# EAGLE design Frequency_synthesizer_v2.0 (EAGLE 9.6.2)

## Sheet 1 of 2
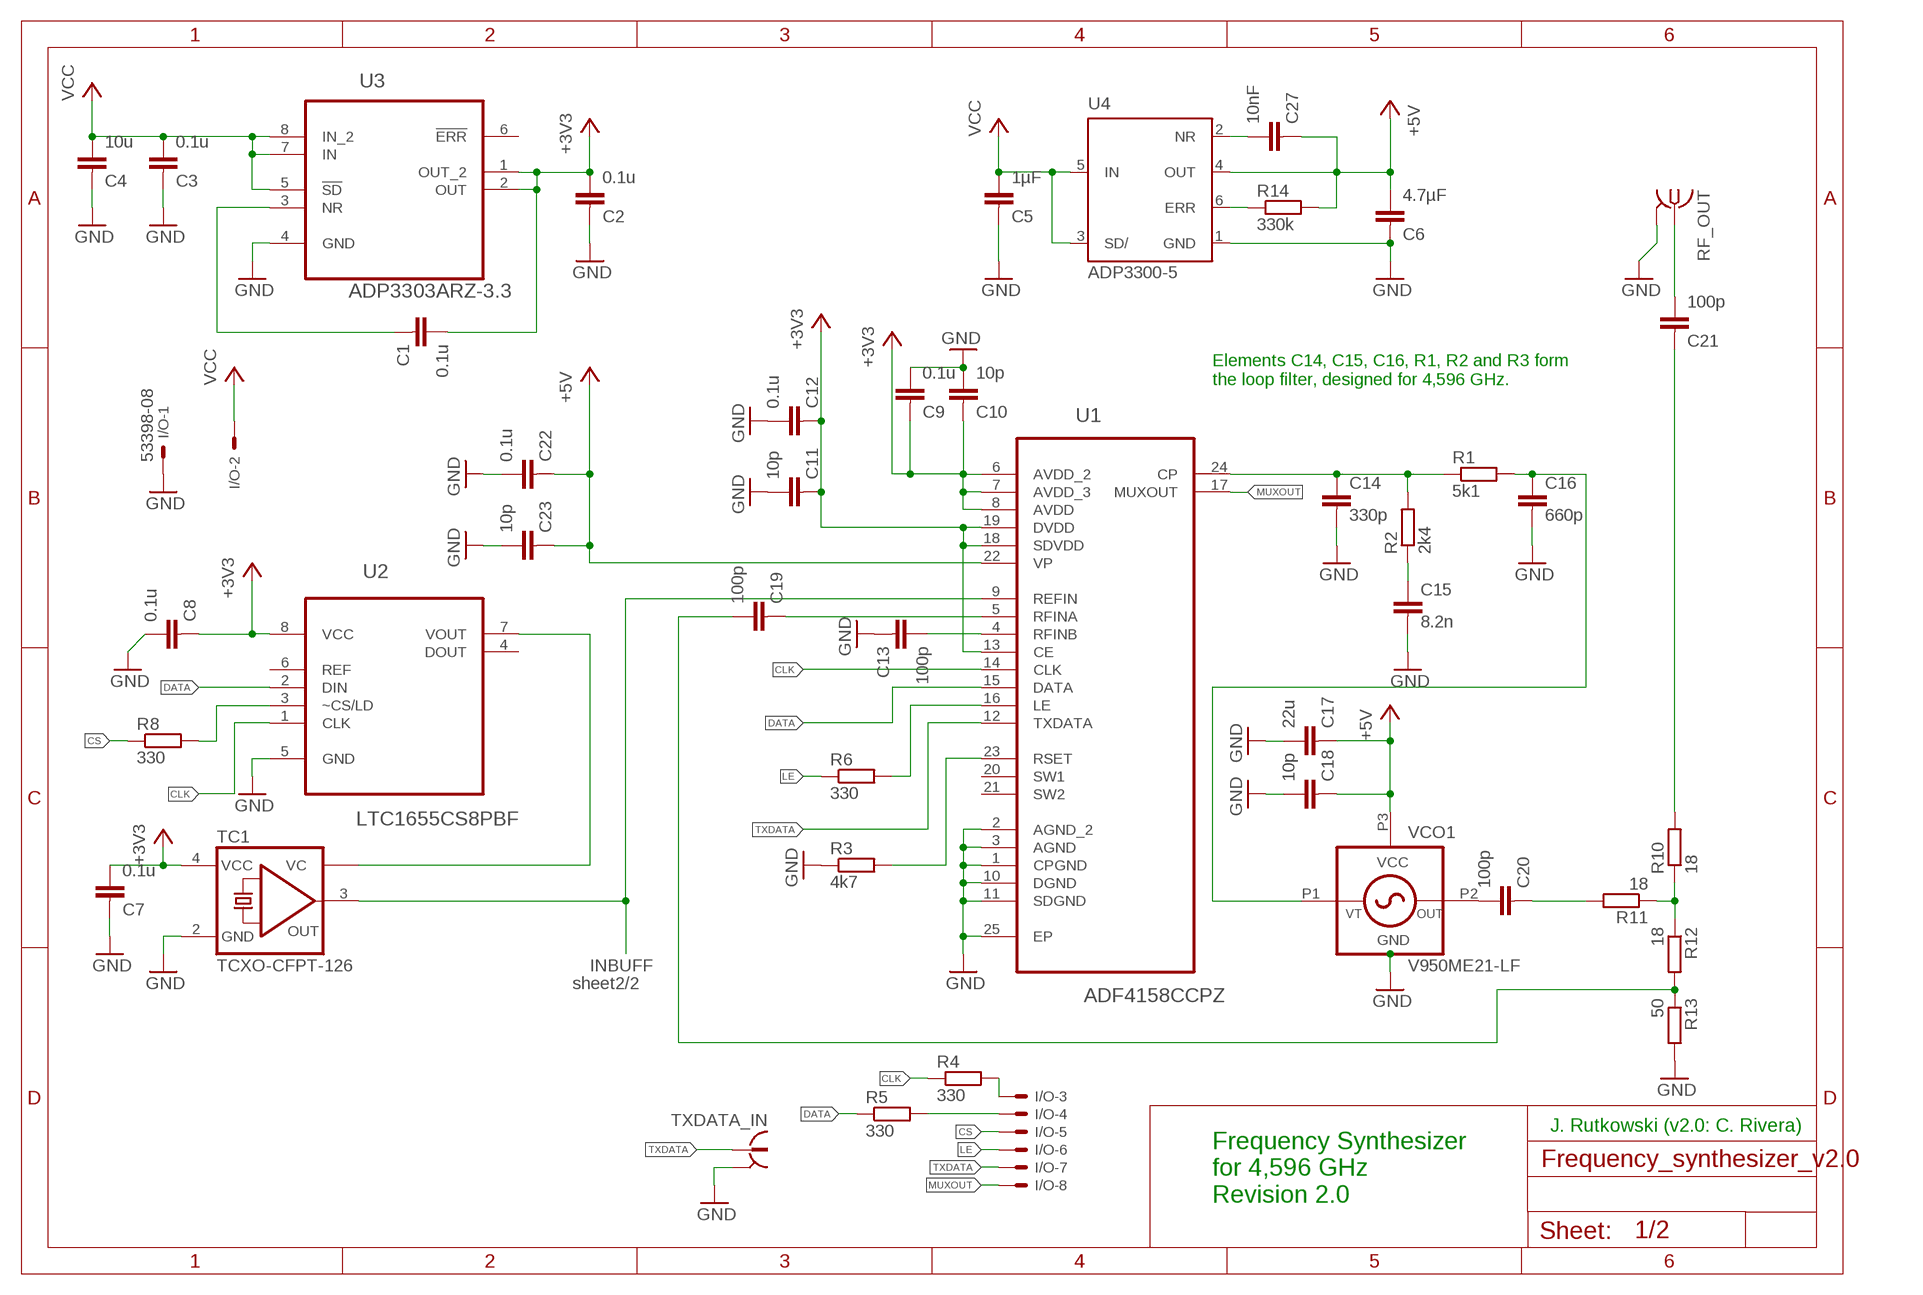
[diagram p0: schematic, sheet 1]

### Parts
C1  0.1u  C-EUC0603K  [C0603K]
C2  0.1u  C-EUC0603K  [C0603K]
C3  0.1u  C-EUC0603K  [C0603K]
C4  10u  C-EUC0805K  [C0805K]
C5  1µF  C-EUC0603K  [C0603K]
C6  4.7µF  C-EUC0603K  [C0603K]
C7  0.1u  C-EUC0603K  [C0603K]
C8  0.1u  C-EUC0603K  [C0603K]
C9  0.1u  C-EUC0603K  [C0603K]
C10  10p  C-EUC0603K  [C0603K]
C11  10p  C-EUC0603K  [C0603K]
C12  0.1u  C-EUC0603K  [C0603K]
C13  100p  C-EUC0402  [C0402]
C14  330p  C-EUC0603K  [C0603K]
C15  8.2n  C-EUC0603K  [C0603K]
C16  660p  C-EUC0603K  [C0603K]
C17  22u  C-EUC0805  [C0805]
C18  10p  C-EUC0603K  [C0603K]
C19  100p  C-EUC0402  [C0402]
C20  100p  C-EUC0402  [C0402]
C21  100p  C-EUC0402  [C0402]
C22  0.1u  C-EUC0603K  [C0603K]
C23  10p  C-EUC0603K  [C0603K]
C27  10nF  C-EUC0603K  [C0603K]
I/O  53398-08  [53398-08]
R1  5k1  R-EU_R0603  [R0603]
R2  2k4  R-EU_R0603  [R0603]
R3  4k7  R-EU_R0603  [R0603]
R4  330  R-EU_R0603  [R0603]
R5  330  R-EU_R0603  [R0603]
R6  330  R-EU_R0603  [R0603]
R8  330  R-EU_R0603  [R0603]
R10  18  R-EU_R0402  [R0402]
R11  18  R-EU_R0402  [R0402]
R12  18  R-EU_R0402  [R0402]
R13  50  R-EU_R0402  [R0402]
R14  330k  R-EU_R0603  [R0603]
RF_OUT  SMA-142-0711-871/876  [J502-ND-142-0711-871/876]
TC1  TCXO-CFPT-126  [7.0X5.0-4-PAD]
TXDATA_IN  734120110  [734120110]
U1  ADF4158CCPZ  [QFN50P400X400X80-25N]
U2  LTC1655CS8PBF  [SOIC127P600X175-8N]
U3  ADP3303ARZ-3.3  [SOIC127P600X175-8N]
U4  ADP3300-5  [SOT23-6]
VCO1  V950ME21-LF  MINI-14S  [MINI-14S]

### Nets
+3V3: C1.1 C2.1 C7.1 C8.2 C9.2 C10.2 C11.2 C12.2 TC1.4(VCC) U1.6(AVDD_2) U1.7(AVDD_3) U1.8(AVDD) U1.13(CE) U1.18(SDVDD) U1.19(DVDD) U2.8(VCC) U3.1(OUT_2) U3.2(OUT) ; also sheet 2
+5V: C6.1 C17.2 C18.2 C22.2 C23.2 C27.2 R14.2 U1.22(VP) U4.4(OUT) VCO1.P3(VCC)
CLK: R4.1 U1.14(CLK) U2.1(CLK)
CS: I/O.5 R8.1
DATA: R5.1 U1.15(DATA) U2.2(DIN)
GND: C2.2 C3.2 C4.2 C5.2 C6.2 C7.2 C8.1 C9.1 C10.1 C11.1 C12.1 C13.2 C14.2 C15.2 C16.2 C17.1 C18.1 C22.1 C23.1 I/O.1 R3.1 R13.2 RF_OUT.G@1 RF_OUT.G@2 RF_OUT.G@3 RF_OUT.G@4 TC1.2(GND) TXDATA_IN.S@1 TXDATA_IN.S@2 TXDATA_IN.S@3 U1.1(CPGND) U1.2(AGND_2) U1.3(AGND) U1.10(DGND) U1.11(SDGND) U1.25(EP) U2.5(GND) U3.4(GND) U4.1(GND) VCO1.S1 VCO1.S2 VCO1.S3 VCO1.S4 VCO1.S5 VCO1.S6 VCO1.S7 VCO1.S8 VCO1.S9 VCO1.S10 VCO1.S11 ; also sheet 2
INBUFF: TC1.3(OUT) U1.9(REFIN) ; also sheet 2
LE: I/O.6 R6.1
MUXOUT: I/O.8 U1.17(MUXOUT)
N$1: C14.1 R1.1 R2.2 U1.24(CP)
N$2: C16.1 R1.2 VCO1.P1(VT)
N$3: C1.2 U3.3(NR)
N$4: C15.1 R2.1
N$5: C13.1 U1.4(RFINB)
N$6: R8.2 U2.3(~CS/LD)
N$7: I/O.4 R5.2
N$8: I/O.3 R4.2
N$9: R14.1 U4.6(ERR)
N$10: TC1.1(VC) U2.7(VOUT)
N$13: R6.2 U1.16(LE)
N$14: R3.2 U1.23(RSET)
N$15: C20.1 VCO1.P2(OUT)
N$16: C20.2 R11.2
N$17: R10.1 R11.1 R12.1
N$18: C19.1 R12.2 R13.1
N$19: C21.2 R10.2
N$20: C21.1 RF_OUT.1
N$21: C19.2 U1.5(RFINA)
N$26: C27.1 U4.2(NR)
TXDATA: I/O.7 TXDATA_IN.1 U1.12(TXDATA)
VCC: C3.1 C4.1 C5.1 I/O.2 U3.5(!SD) U3.7(IN) U3.8(IN_2) U4.3(SD/) U4.5(IN)
Unconnected: U1.20(SW1) U1.21(SW2) U2.4(DOUT) U2.6(REF) U3.6(!ERR)

### Notes on the sheet
- Elements C14, C15, C16, R1, R2 and R3 form
  the loop filter, designed for 4,596 GHz.
- sheet2/2
- J. Rutkowski (v2.0: C. Rivera)
- Frequency Synthesizer
  for 4,596 GHz
  Revision 2.0

## Sheet 2 of 2
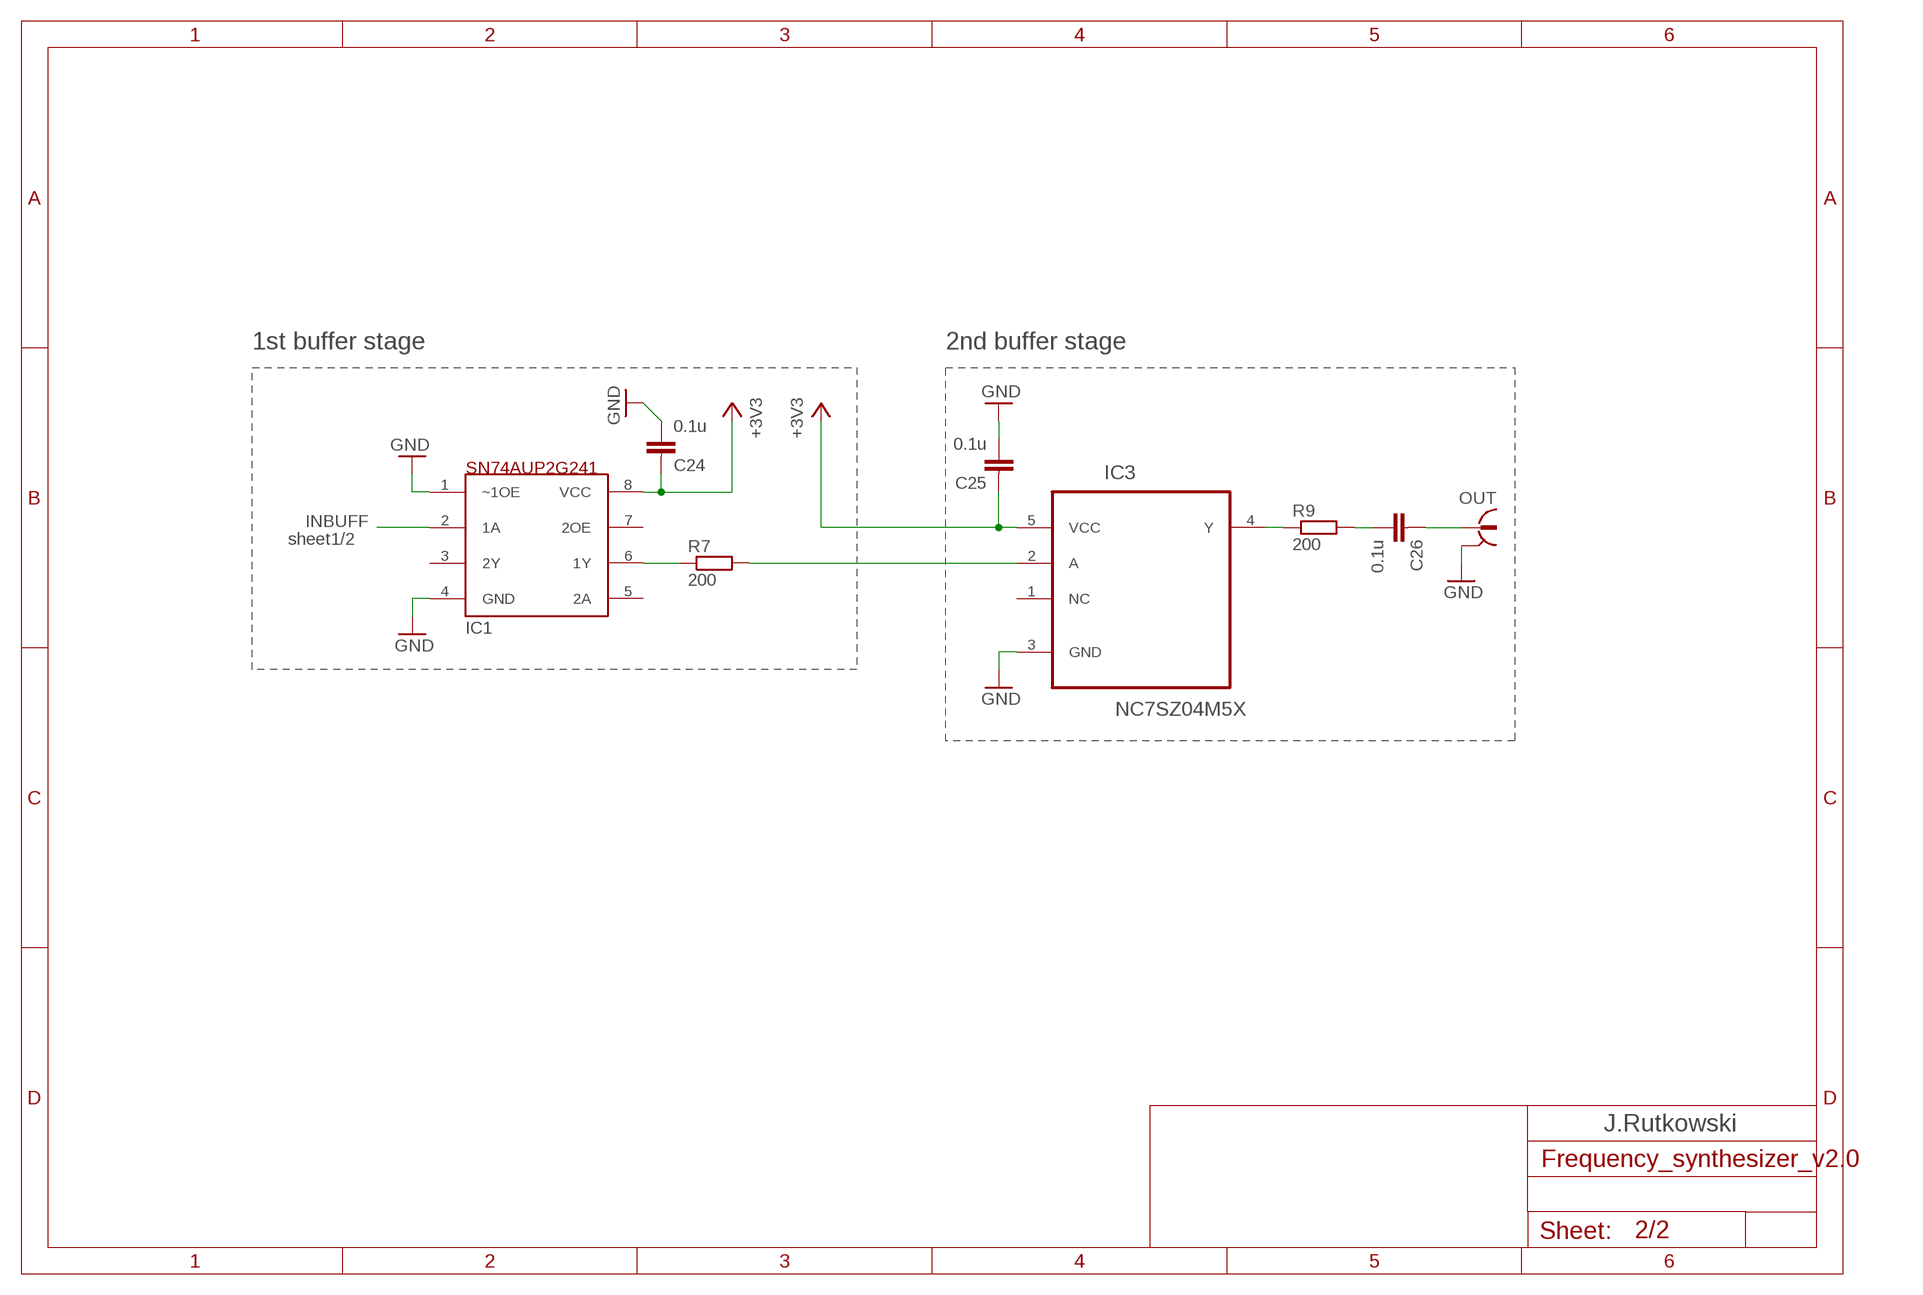
[diagram p1: schematic, sheet 2]

### Parts
C24  0.1u  C-EUC0603K  [C0603K]
C25  0.1u  C-EUC0603K  [C0603K]
C26  0.1u  C-EUC0603K  [C0603K]
IC1  SN74AUP2G241  [DCU_(R-PDSO-G8)]
IC3  NC7SZ04M5X  [SOT95P280X145-5N]
OUT  734120110  [734120110]
R7  200  R-EU_R0603  [R0603]
R9  200  R-EU_R0603  [R0603]

### Nets
+3V3: C24.2 C25.2 IC1.8(VCC) IC3.5(VCC) ; also sheet 1
GND: C24.1 C25.1 IC1.1(~1OE) IC1.4(GND) IC3.3(GND) OUT.S@1 OUT.S@2 OUT.S@3 ; also sheet 1
INBUFF: IC1.2(1A) ; also sheet 1
N$12: IC1.6(1Y) R7.1
N$22: IC3.2(A) R7.2
N$23: IC3.4(Y) R9.1
N$24: C26.1 R9.2
N$25: C26.2 OUT.1
Unconnected: IC1.3(2Y) IC1.5(2A) IC1.7(2OE) IC3.1(NC)

### Notes on the sheet
- 1st buffer stage | 2nd buffer stage
- sheet1/2
- J.Rutkowski

## Library data of the parts
C1-C27 = rcl:C-EU: CAPACITOR, European symbol
I/O = con-molex:53?-08: CONNECTOR wire to board 1.25 mm (.049 inch) pitch header; OC_FARNELL: 1125371; OC_NEWARK: unknown
IC1 = texas:SN74AUP2G241
IC3 = Custom-parts:NC7SZ04M5X: Tiny logic UHS Inverter; MPN: NC7SZ04M5X; OC_FARNELL: 1417667; OC_NEWARK: 58K1973; PACKAGE: SOT-23-5; SUPPLIER: Fairchild
OUT TXDATA_IN = con-coax:734120110: MICRO COAXIAL CONNECTOR RECEPTACLE VERTICAL Source: Data sheet <http://www.molex.com/pdm_docs/sd/734120110_sd.pdf>
R1-R14 = rcl:R-EU_: RESISTOR, European symbol
RF_OUT = con-coax:SMA-: SMA 50 Ohm End Launch Jack Receptacle - Round Contact Johnson Components Source: www.johnsoncomponents.com .. J502-ND.pdf; MF: JOHNSON COMPONENTS; MPN: 142-0711-871; OC_FARNELL: unknown; OC_NEWARK: 01C1639
TC1 = IQD-Frequency-Products:TCXO: CRYSTAL RESONATOR
U1 = AD_PLL:ADF4158CCPZ: Frequency Synthesizer; MPN: ADF4158CCPZ; OC_FARNELL: -; OC_NEWARK: 76R7557; PACKAGE: LFCSP-24; SUPPLIER: Analog Devices
U2 = LTC_By_element14_Batch_1:LTC1655CS8PBF: 16-Bit Rail-to-Rail Micropower DAC; MPN: LTC1655CS8#PBF; OC_FARNELL: 1663654; OC_NEWARK: 56M2907; PACKAGE: SOIC-8; SUPPLIER: Linear Technology
U3 = analog-devices:ADP3303ARZ-3.3: Linear Regulator; MPN: ADP3303ARZ-3.3; OC_FARNELL: 2305721; OC_NEWARK: 59K2583; PACKAGE: SOIC-8; SUPPLIER: ANALOG DEVICES
U4 = analog-devices:ADP3300-5; DIGIKEY: ADP3300ARTZ-5REEL7CT-ND
VCO1 = z-comm:MINI-14S: VCO

## Board
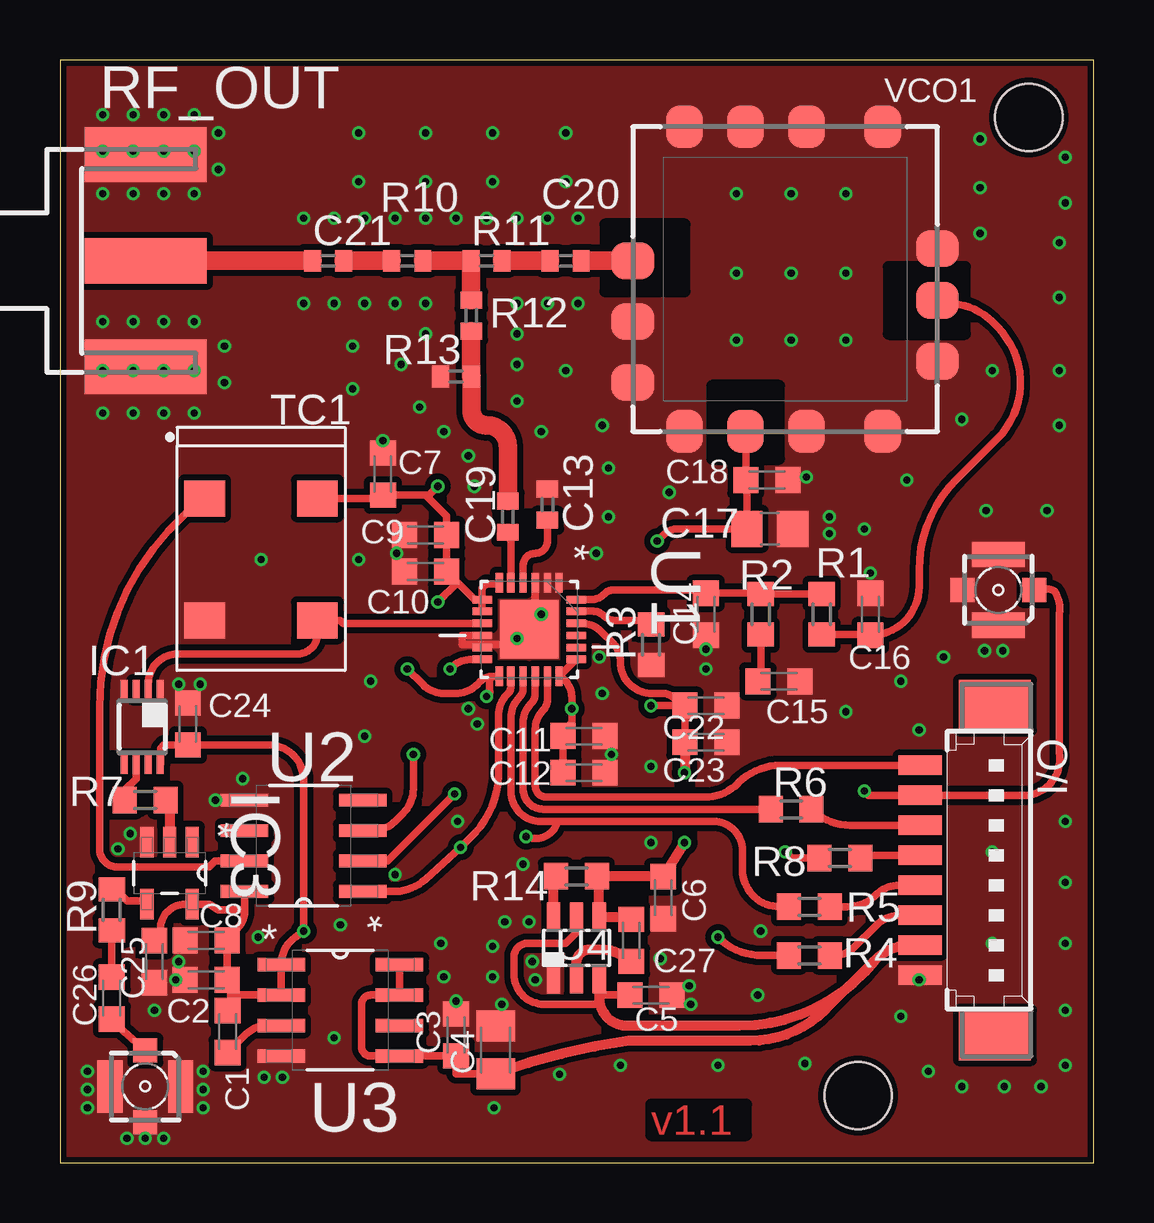
[diagram p2: board, top side]
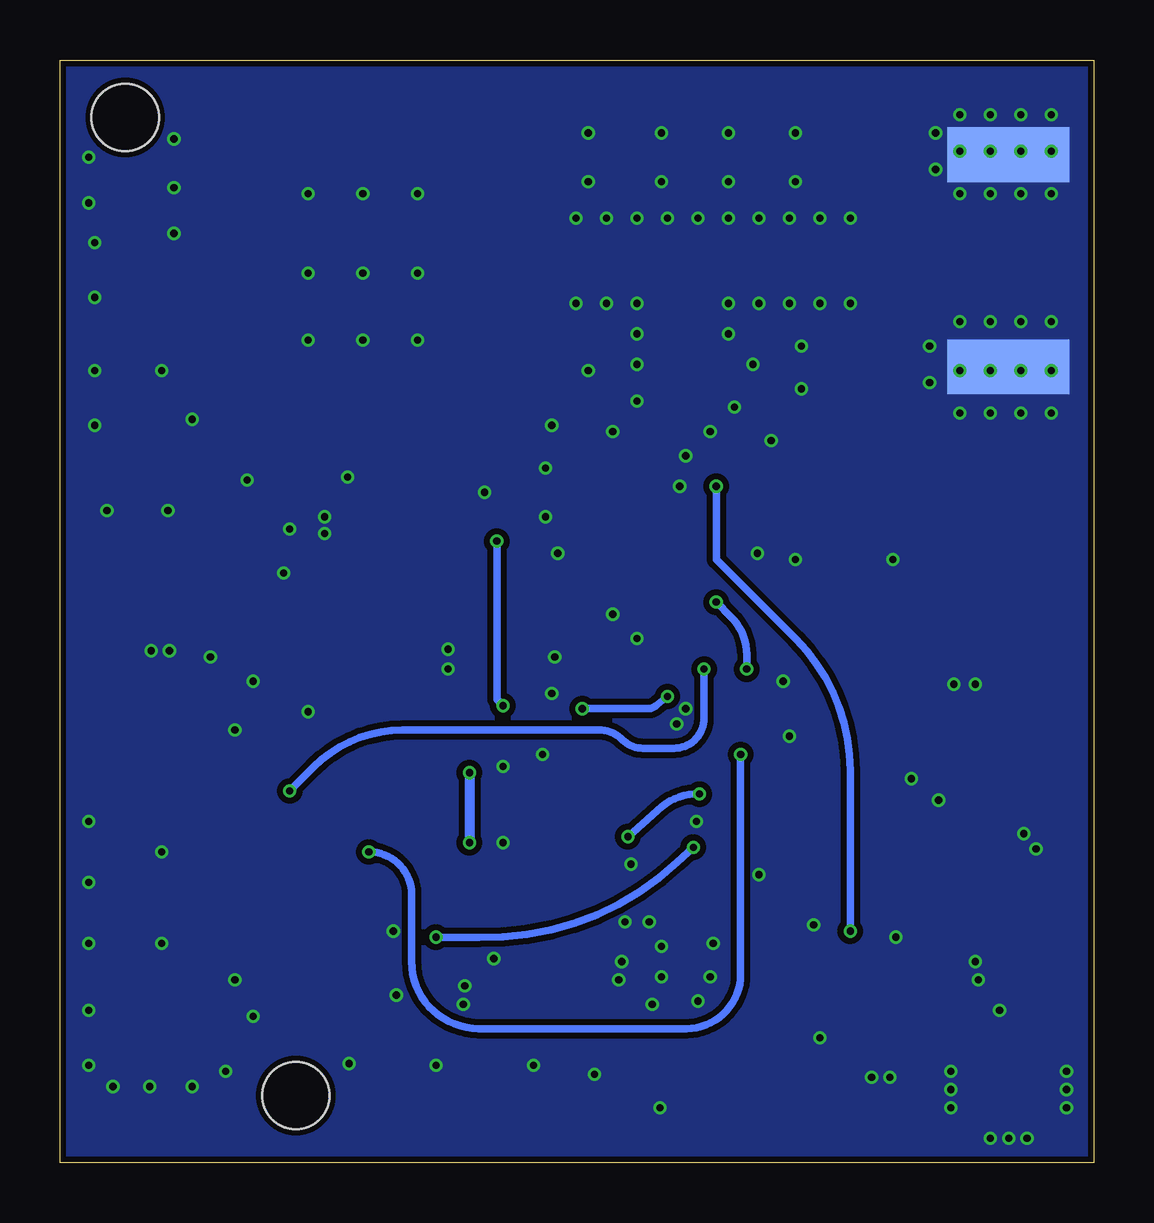
[diagram p3: board, bottom side, seen from below]

Size 43.1 x 45.96 mm. Coordinates in mm from the lower left corner, seen from the top.
Outline: 0,0 43.1,0 43.1,45.96 0,45.96 0,0
Copper layers (1*16): Top 0.018mm / dielectric 1.55mm / Bottom 0.018mm
Design rules "eC_2Layer_PClass6_BaseCopperO18_eCDefault *": minimum track width 0.15mm, minimum drill 0.35mm, track to track 0.15mm, track to pad 0.15mm, pad to pad 0.15mm, via to via 0.15mm, smd to smd 0mil, copper to edge 0.25mm, drill to drill 0.35mm, minimum pad ring 0.175mm, minimum via ring 0.125mm, stop-mask expansion 0mil, vias tented up to drill 0.45mm, thermal gap 0.2mm
Holes 2.8 mm at 40.39,43.56 33.27,2.79

### Footprints (pad centres in the part's own frame; a part is rotated, then mirrored left to right if it is on the bottom)
C0603K = smd 1.05 x 1.08: 1 -0.875,0; 2 0.875,0
C0805K = smd 1.3 x 1.6: 1 -1,0; 2 1,0
C0402 = smd 0.7 x 0.9: 1 -0.65,0; 2 0.65,0
C0805 = smd 1.3 x 1.5: 1 -0.95,0; 2 0.95,0
53398-08 = smd 0.8 x 1.8: 1 4.375,-2.5; 2 3.125,-2.5; 3 1.875,-2.5; 4 0.625,-2.5; 5 -0.625,-2.5; 6 -1.875,-2.5; 7 -3.125,-2.5; 8 -4.375,-2.5 | smd 2.1 x 3: S1 6.875,0.625; S2 -6.875,0.625
DCU_(R-PDSO-G8) = smd 0.3 x 0.8: 1 -0.75,-1.55; 2 -0.25,-1.55; 3 0.25,-1.55; 4 0.75,-1.55; 5 0.75,1.55; 6 0.25,1.55; 7 -0.25,1.55; 8 -0.75,1.55
SOT95P280X145-5N = smd 1.27 x 0.559: 1 -1.295,0.94; 2 -1.295,0; 3 -1.295,-0.94; 4 1.295,-0.94; 5 1.295,0.94
734120110 = smd 1 x 1: 1 0,-1.5; S@1 0,1.5 | smd 1.05 x 2.2: S@2 -1.475,0; S@3 1.475,0
R0603 = smd 1 x 1.1: 1 -0.85,0; 2 0.85,0
R0402 = smd 0.7 x 0.9: 1 -0.65,0; 2 0.65,0
J502-ND-142-0711-871/876 = smd 5.08 x 1.905: 1 2.565,0 | smd 5.08 x 2.286: G@1 2.565,4.42; G@2 2.565,-4.42 | smd 5.08 x 2.286 bottom: G@3 2.565,4.42; G@4 2.565,-4.42
7.0X5.0-4-PAD = smd 1.5 x 1.7: 1 -2.54,-2.35; 2 2.54,-2.35; 3 2.54,2.35; 4 -2.54,2.35
QFN50P400X400X80-25N = smd 0.813 x 0.305: 1 -1.956,1.245; 2 -1.956,0.762; 3 -1.956,0.254; 4 -1.956,-0.254; 5 -1.956,-0.762; 6 -1.956,-1.245; 13 1.956,-1.245; 14 1.956,-0.762; 15 1.956,-0.254; 16 1.956,0.254; 17 1.956,0.762; 18 1.956,1.245 | smd 0.305 x 0.813: 7 -1.245,-1.956; 8 -0.762,-1.956; 9 -0.254,-1.956; 10 0.254,-1.956; 11 0.762,-1.956; 12 1.245,-1.956; 19 1.245,1.956; 20 0.762,1.956; 21 0.254,1.956; 22 -0.254,1.956; 23 -0.762,1.956; 24 -1.245,1.956 | smd 2.438 x 2.438: 25 0,0
SOIC127P600X175-8N = smd 1.981 x 0.533: 1 -2.464,1.905; 2 -2.464,0.635; 3 -2.464,-0.635; 4 -2.464,-1.905; 5 2.464,-1.905; 6 2.464,-0.635; 7 2.464,0.635; 8 2.464,1.905
SOIC127P600X175-8N' = smd 1.981 x 0.559: 1 -2.464,1.905; 2 -2.464,0.635; 3 -2.464,-0.635; 4 -2.464,-1.905; 5 2.464,-1.905; 6 2.464,-0.635; 7 2.464,0.635; 8 2.464,1.905
SOT23-6 = smd 0.55 x 1.2: 1 -0.95,-1.3; 2 0,-1.3; 3 0.95,-1.3; 4 0.95,1.3; 5 0.003,1.3; 6 -0.95,1.3
MINI-14S = smd 1.524 x 1.778: P1 -0.889,-6.35; P2 0.762,6.35; S1 -3.429,-6.35; S2 1.27,-6.35; S7 -1.778,6.35; S8 -4.318,6.35 | smd 1.778 x 1.524: P3 -6.35,1.651; S3 6.35,-4.064; S4 6.35,-0.889; S5 6.35,1.651; S6 6.35,4.191; S9 -6.35,4.191; S10 -6.35,-0.889; S11 -6.35,-4.064

### Placement (x,y rotation side)
C1  6.99,5.46 270 top
C2  6.1,7.62 180 top
C3  16.51,5.33 90 top
C4  18.16,4.7 90 top
C5  24.64,6.99 0 top
C6  25.15,11.05 270 top
C7  13.46,28.7 90 top
C8  6.1,9.27 0 top
C9  15.24,26.16 0 top
C10  15.24,24.64 0 top
C11  21.84,17.78 180 top
C12  21.84,16.26 180 top
C13  20.32,27.43 90 top
C14  26.92,22.86 270 top
C15  29.97,20.07 0 top
C16  33.78,22.86 90 top
C17  29.59,26.42 180 top
C18  29.46,28.45 180 top
C19  18.67,26.92 270 top
C20  21.08,37.59 180 top
C21  11.18,37.59 0 top
C22  26.92,19.05 180 top
C23  26.92,17.53 180 top
C24  5.33,18.29 270 top
C25  3.94,8.38 90 top
C26  2.16,6.86 270 top
C27  23.81,9.27 90 top
I/O  38.35,12.19 270 top
IC1  3.43,18.16 180 top
IC3  4.57,12.06 270 top
OUT  3.56,3.17 180 top
R1  31.75,22.86 270 top
R2  29.21,22.86 90 top
R3  24.64,21.59 90 top
R4  31.24,8.64 0 top
R5  31.24,10.67 0 top
R6  30.48,14.73 180 top
R7  3.56,15.11 0 top
R8  32.51,12.7 180 top
R9  2.16,10.54 270 top
R10  14.48,37.59 180 top
R11  17.78,37.59 0 top
R12  17.14,35.31 270 top
R13  16.51,32.77 180 top
R14  21.53,11.94 0 top
RF_OUT  1.02,37.59 0 top
TC1  8.38,25.15 270 top
TXDATA_IN  39.12,23.88 90 top
U1  19.56,22.23 270 top
U2  10.16,13.21 180 top
U3  ADP3303ARZ-3.3  [SOIC127P600X175-8N']  11.68,6.35 0 top
U4  21.53,8.95 0 top
VCO1  30.23,36.83 90 top

### Tracks (layer width: path | path; a pad name or v marks a point on that pad's centre or on a via)
+3V3  (via drill 0.3)
  Top 0.305: U1.19 U1.18 20.88,20.27 21.05,20.09 arc-45 21.34,19.41 v21.34,18.92 21.34,18.4 C11.2 C12.2 | U1.7 17.28,23.47 16.57,24.19 | 16.57,24.19 C10.2 C9.2 16.11,26.95 15.24,27.83 | U1.7 17.6,23.95 17.78,24.13 18.26,24.13 U1.6 | U1.8 U1.7 | TC1.4 13.32,27.69 C7.1 15.24,27.83 | 7.11,7.51 C2.1 | 15.24,27.83 15.38,27.83 v15.75,28.19 | v14.48,20.57 15.13,19.92 arc45 16.01,19.56 16.48,19.56 arc45 17.4,19.94 17.52,20.06 arc-45 18.03,20.27 U1.13 18.11,20.27 arc90 17.91,20.07 17.91,19.68 arc-90 v17.78,19.43 | 16,23.62 v15.75,23.37 16.57,24.19 | 7.11,7.51 6.97,7.65 C8.2 7.49,9.88 arc40 7.7,10.45 7.7,10.54 | 7.7,10.54 U2.8 | 7.7,10.54 6.6,10.54 6.25,10.77 IC3.5 5.2,10.77 arc90 4.19,9.76 4.19,9.51 C25.2 | IC1.8 4.19,16.62 4.19,17.27 4.33,17.41 C24.2 8.69,17.41 arc-90 10.16,15.94 v10.16,9.65 9.79,9.38 arc54 U3.1 U3.2 7.11,6.99 | 7.11,7.51 7.11,6.99 | 7.11,6.99 7.11,6.46 C1.1
  Bottom 0.305: v15.75,28.19 15.75,25.15 12.43,21.83 arc45 10.16,16.34 v10.16,9.65 | v14.48,20.57 14.48,21.18 arc-45 15.13,22.75 v15.75,23.37 | v17.78,19.43 18.28,19.03 arc39 18.59,18.92 v21.34,18.92
+5V  (via drill 0.3)
  Top 0.305: U1.22 21.75,22.48 arc-45 22.56,22.14 23.05,21.65 arc-45 23.37,20.89 23.37,20.85 arc45 23.74,19.95 arc45 24.68,19.56 25.13,19.56 arc-45 25.59,19.37 25.91,19.05 C22.2 | C23.2 C22.2 | v24.89,25.91 25.13,26.15 arc-45 25.78,26.42 C17.2 28.64,28.4 arc90 C18.2 28.59,30.47 arc90 VCO1.P3 | v24.64,19.05 C22.2
  Top 0.406: C27.2 23.81,10.25 U4.4 22.48,11.84 arc90 R14.2 arc90 22.39,11.92 C6.1 v26.04,13.34 | C23.2 v26.05,16.27 arc-90 v26.04,16.26
  Bottom 0.305: v24.89,25.91 24.89,19.3 v24.64,19.05
  Bottom 0.406: v26.04,16.26 v26.04,13.34
CLK  (via drill 0.3)
  Top 0.305: R4.1 29.27,8.64 arc-45 v27.43,9.4 | U1.14 18.8,19.84 arc-45 18.69,19.58 arc45 18.29,18.74 18.29,16.44 arc-45 17.31,13.76 v16.7,13.14 15.23,11.8 arc-45 13.82,11.3 U2.1
  Bottom 0.305: v27.43,9.4 25.64,9.4 arc-45 17.37,12.54 v16.7,13.14
CS
  Top 0.305: I/O.5 33.48,12.82 R8.1
DATA  (via drill 0.3)
  Top 0.305: U1.15 19.3,19.75 arc-45 19.17,19.42 19.16,19.42 arc45 18.8,18.53 18.8,15.48 arc90 20.05,14.22 20.7,14.22 | R5.1 30,10.67 arc-90 28.45,12.22 28.45,13.03 arc90 27.25,14.22 20.7,14.22 | v19.43,13.59 arc90 20.7,14.1 20.7,14.22 | U2.2 13.65,12.57 v16.45,15.37
  Bottom 0.305: v16.45,15.37 arc-45 18.2,14.69 v19.43,13.59
GND  (via drill 0.3)
  Top 0.305: U1.3 19.81,22.48 U1.25 arc-90 18.92,21.59 16.76,21.59 16.76,21.97 U1.10
  other vias: 22.61,19.56 26.92,20.57 10.16,39.37 11.43,39.37 12.7,39.37 13.97,39.37 15.24,39.37 16.51,39.37 17.78,39.37 19.05,39.37 20.32,39.37 21.59,39.37 10.16,35.81 11.43,35.81 12.7,35.81 13.97,35.81 15.24,35.81 15.24,34.54 19.05,35.81 20.32,35.81 21.59,35.81 19.05,34.54 14.22,33.27 19.05,33.27 17.27,28.19 14.99,31.5 16,30.48 17.02,29.46 20.07,30.48 21.08,33.02 24.64,16.51 19.05,21.84 20.07,22.86 1.78,43.69 3.05,43.69 4.32,43.69 5.59,43.69 6.6,42.93 6.6,41.4 5.59,40.39 4.32,40.39 3.05,40.39 1.78,40.39 1.78,35.05 3.05,35.05 4.32,35.05 5.59,35.05 6.86,34.04 6.86,32.51 5.59,31.24 4.32,31.24 3.05,31.24 1.78,31.24 12.19,34.04 12.19,32.26 12.45,42.93 12.45,40.89 15.24,42.93 15.24,40.89 18.03,42.93 18.03,40.89 21.08,42.93 21.08,40.89 19.05,31.75 22.61,30.73 22.86,28.96 22.86,26.92 25.4,27.94 28.19,40.39 30.48,40.39 32.77,40.39 28.19,37.08 30.48,37.08 32.77,37.08 28.19,34.29 30.48,34.29 32.77,34.29 41.91,41.91 38.35,42.67 38.35,40.64 41.91,40.01 38.35,38.73 41.66,38.35 41.66,33.02 38.86,33.02 35.31,28.45 33.53,26.42 41.15,27.18 41.91,4.06 41.66,30.73 37.59,30.99 41.91,11.68 35.05,6.1 41.91,14.22 41.91,9.14 35.05,20.07 32.77,18.8 22.35,25.4 8.38,25.15 12.45,25.15 12.7,17.78 12.95,20.07 18.1,2.29 23.37,4.06 27.43,4.06 31.05,4.13 39.37,3.17 38.86,12.95 38.86,9.14 41.91,6.35 41.66,36.07 38.61,27.18 2.92,13.72 2.41,13.08 6.48,15.11 7.62,16 4.95,19.94 5.84,19.94 29.08,6.99 29.21,9.65 19.68,8.38 19.81,7.62 20.83,3.68 4.95,8.38 4.83,7.62 8.51,3.56 9.27,3.56 3.56,1.02 5.97,3.81 5.97,3.05 5.97,2.29 1.14,3.81 1.14,3.05 1.14,2.29 2.79,1.02 4.32,1.02 22.99,17.02 22.48,21.08 17.02,18.92 17.4,18.29 3.94,6.35 8.26,9.4 11.68,9.91 36.2,3.81 38.54,21.34 39.31,21.34 33.78,24.57 26.92,21.4 32.07,26.92 32.07,26.23 31.11,28.57 14.03,25.4 13.46,30.1 13.97,12 16.57,14.22 26.23,7.37 18.03,7.75 18.03,9.02 18.54,10.03 19.56,10.03 26.29,6.6 25.02,8.51 24.64,13.34 18.41,6.6 16.51,6.73 16,7.75 19.3,12.45 37.59,3.17 40.89,3.17 36.83,21.08 35.81,18.03 35.81,7.62 11.43,5.21 15.88,9.14
  pour Top (isolate 0.254): 0.76,45.47 42.93,45.72 43.18,0.25 1.02,0.25
  pour Bottom (isolate 0.254, no thermals): 0.13,45.85 42.93,45.72 43.18,0.25 0.13,0.38
  pour Top (isolate 0.254, no thermals): 42.93,45.72 0.25,45.72 0.25,0.38 43.18,0.25
  pour Top (isolate 0.254): 0.76,45.72 42.93,45.72 43.18,0.51 0.25,0.38
INBUFF
  Top 0.305: U1.9 11.81,22.48 11.68,22.61 TC1.3 10.73,21.97 arc-90 9.84,21.21 4.92,21.21 arc90 3.68,19.97 IC1.2
LE
  Top 0.305: I/O.6 32.94,14.07 arc-45 R6.1
MUXOUT
  Top 0.305: U1.17 20.32,19.28 arc-45 20.16,18.89 arc45 19.81,18.06 19.81,15.7 arc90 20.27,15.24 26.89,15.24 arc45 28.25,15.81 28.29,15.84 arc-45 30.04,16.57 I/O.8
N$1
  Top 0.305: R1.1 R2.2 29.18,23.73 C14.1 26.78,23.88 23.09,23.88 arc45 22.69,23.71 arc-45 22.11,23.47 U1.24
N$2
  Top 0.305: R1.2 33.76,22.01 C16.1 arc90 35.81,24.02 35.81,24.7 arc-45 37.39,28.5 39.06,30.18 arc90 39.06,34.85 38.87,35.05 arc45 37.02,35.81 36.7,35.81 VCO1.P1
N$3
  Top 0.305: U3.3 8.64,5.71 arc45 7.74,5.34 C1.2
N$4
  Top 0.305: R2.1 29.21,20.18 C15.1
N$5
  Top 0.305: U1.4 19.3,24.89 arc-90 19.81,25.4 arc90 20.32,25.91 C13.1
N$6  (via drill 0.3)
  Top 0.305: R8.2 30.48,12.7 v30.23,12.95 | U2.3 13.04,13.84 arc45 13.98,14.23 14.31,14.56 arc45 14.73,15.59 v14.73,17.02
  Bottom 0.305: v30.23,12.95 arc90 28.45,11.18 28.45,8.39 arc-90 25.65,5.59 16.99,5.59 arc-90 14.73,7.85 v14.73,17.02
N$7
  Top 0.305: R5.2 32.81,10.67 arc45 34.03,11.17 arc-45 34.98,11.57 I/O.4
N$8
  Top 0.305: I/O.3 35.06,10.32 arc45 34.01,9.88 33.12,8.99 arc-45 32.27,8.64 R4.2
N$9
  Top 0.406: U4.6 20.58,11.84 arc-90 R14.1
N$10
  Top 0.305: TC1.1 arc54 1.65,19.01 1.65,13.09 arc90 2.42,12.32 6.22,12.32 6.48,12.57 U2.7
N$12
  Top 0.305: R7.1 2.71,15.53 3.17,16 IC1.6
N$13
  Top 0.305: U1.16 19.81,19.57 arc-45 19.62,19.11 arc45 19.3,18.35 19.3,15.58 arc90 20.16,14.73 R6.2
N$14
  Top 0.305: U1.23 22.21,22.99 arc-45 22.67,22.8 arc45 23.13,22.61 24.47,22.61 R3.2
N$15
  Top 0.762: VCO1.P2 C20.1
N$16
  Top 0.762: C20.2 R11.2
N$17
  Top 0.762: R12.1 arc-90 R12.1 R11.1 R10.1
N$18
  Top 0.305: 17.14,32.78 R13.1
  Top 0.762: 17.14,32.78 R12.2 | R13.1 17.16,31.35 arc90 17.78,30.73 arc-90 18.67,29.84 C19.1
N$19
  Top 0.762: R10.2 C21.2
N$20
  Top 0.762: C21.1 RF_OUT.1
N$21
  Top 0.305: U1.5 18.8,25.89 C19.2
N$22
  Top 0.406: R7.2 4.57,14.95 IC3.2
N$23
  Top 0.305: R9.1 2.33,11.39 2.79,10.92 3.48,10.92 IC3.4
N$24
  Top 0.305: C26.1 R9.2
N$25
  Top 0.305: C26.2 2.29,5.82 OUT.1
N$26
  Top 0.406: C27.1 23.73,8.4 arc45 22.54,8.89 22.1,8.89 arc90 21.53,8.32 U4.2
N$30  (via drill 0.3)
  other vias: 1.78,42.16
N$31  (via drill 0.3)
  other vias: 3.05,42.16
N$32  (via drill 0.3)
  other vias: 4.32,42.16
N$33  (via drill 0.3)
  other vias: 5.59,42.16
N$42  (via drill 0.3)
  other vias: 1.78,33.02
N$43  (via drill 0.3)
  other vias: 3.05,33.02
N$44  (via drill 0.3)
  other vias: 4.32,33.02
N$45  (via drill 0.3)
  other vias: 5.59,33.02
TXDATA  (via drill 0.3)
  Top 0.305: v33.53,15.49 33.7,15.32 I/O.7 40.4,15.32 arc90 41.66,17.09 41.66,22.89 arc45 41.44,23.84 arc45 40.79,23.88 TXDATA_IN.1 | U1.12 17.15,20.98 arc45 16.32,20.64 v16.26,20.57
  Bottom 0.305: v33.53,15.49 32.53,16.5 arc45 28.81,18.03 20.64,18.03 arc45 19.66,17.62 arc-45 18.8,17.27 17.51,17.27 arc-90 16.26,18.53 v16.26,20.57
VCC
  Top 0.305: C4.1 16.51,3.7 C3.1 15.15,4.46 U3.5 12.95,4.45 arc-90 12.57,4.83 12.57,6.6 arc-90 12.95,6.99 U3.7 U3.8 | C5.1 22.48,6.99 | U4.5 21.53,9.59 21.08,9.14 19.49,9.14 arc90 18.92,8.58 18.92,7.86 arc90 20.18,6.6 22.47,6.6 22.48,6.87
  Top 0.406: I/O.2 35.48,9.07 arc45 33.97,8.44 | 33.97,8.44 31.91,6.38 arc-45 28.77,5.08 23.7,5.08 arc12 C4.1 | U4.3 22.48,6.99 22.48,6.87 arc90 23.63,5.71 28.32,5.71 arc52 33.97,8.44

### Text on the board
Top: v1.1
Top_leg: RF Out | VCO | C21 | R10 | R11 | C20 | R12 | Freq. Synth. / Rev. 1.0 / FEMTO-ST 2016 | C7 | TCXO | C19 | C18 | C9 | C13 | C17 | R1 | C16 | Trig | C10 | C14 | R2 | R3 | C15 | C22 | 8 | 10MHz | C11 | C23 | C12 | R6 | DAC | R8 | C6 | I/O | R5 | ADP | 78M05 | C3 | R4 | C4 | 1 | C5
Bottom_leg: Frequency synthesizer 0.5-6.1 GHz / Rev. 1.0 / FEMTO-ST 2016 | Digital I/O: / 1. GND / 2. VCC / 3. CLK / 4. DATA / 5. DAC CS / 6. ADF4158 LE / 7. TXData / 8. MUXOUT
Top_Legend: IC1 | R1 | C3 | IC3 | C4 | R2 | C6 | C7 | OUT